# EAGLE design simpleArm-1 (EAGLE 9.5.2)
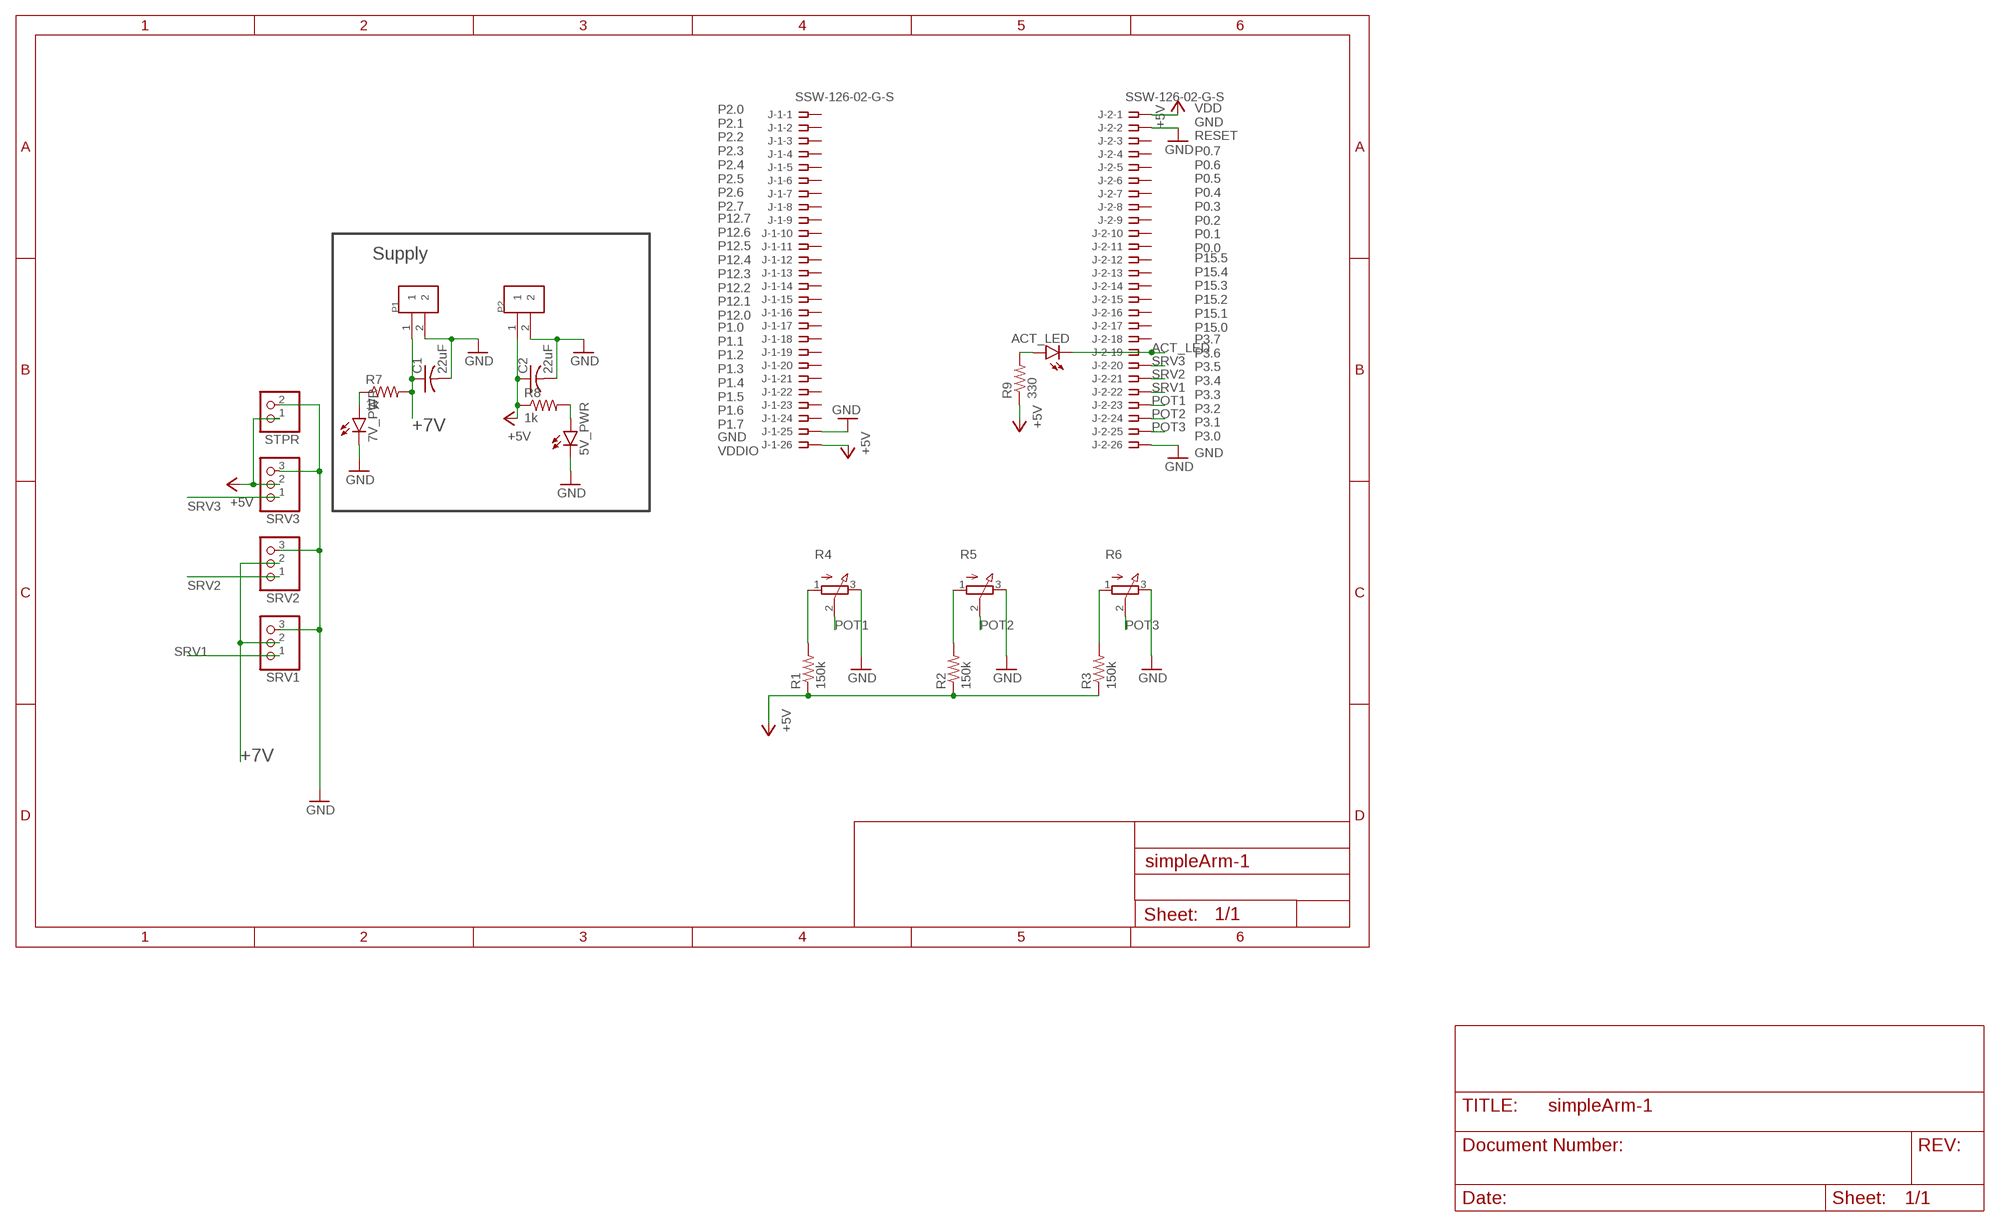
[diagram p0: schematic, sheet 1]

## Parts
5V_PWR  LED3MM  [LED3MM]
7V_PWR  LED3MM  [LED3MM]
ACT_LED  LED3MM  [LED3MM]
C1  22uF  C-US050-030X075  [C050-030X075]
C2  22uF  C-US050-030X075  [C050-030X075]
J-1  SSW-126-02-G-S  [SSW-126-02-G-S]
J-2  SSW-126-02-G-S  [SSW-126-02-G-S]
P1  282837-2  [TE_282837-2]
P2  282837-2  [TE_282837-2]
R1  150k  R-US_0204/7  [0204/7]
R2  150k  R-US_0204/7  [0204/7]
R3  150k  R-US_0204/7  [0204/7]
R4  3RP/1610N  [3RP/1610N]
R5  3RP/1610N  [3RP/1610N]
R6  3RP/1610N  [3RP/1610N]
R7  1k  R-US_0204/7  [0204/7]
R8  1k  R-US_0204/7  [0204/7]
R9  330  R-US_0204/7  [0204/7]
SRV1  PINHD-1X3  [1X03]
SRV2  PINHD-1X3  [1X03]
SRV3  PINHD-1X3  [1X03]
STPR  PINHD-1X2  [1X02]

## Nets
+5V [VCC]: C2.1 J-1.26 J-2.1 P2.1 R1.1 R2.1 R3.1 R8.1 R9.1 SRV3.2 STPR.1
+7V [HighPower]: C1.1 P1.1 R7.2 SRV1.2 SRV2.2
ACT_LED: ACT_LED.K(C) J-2.19
GND [VCC]: 5V_PWR.K(C) 7V_PWR.K(C) C1.2 C2.2 J-1.25 J-2.2 J-2.26 P1.2 P2.2 R4.3(E) R5.3(E) R6.3(E) SRV1.3 SRV2.3 SRV3.3 STPR.2
N$1 [VCC]: R1.2 R4.1(A)
N$2 [VCC]: R2.2 R5.1(A)
N$3 [VCC]: R3.2 R6.1(A)
N$4 [VCC]: 7V_PWR.A R7.1
N$5 [VCC]: 5V_PWR.A R8.2
N$6 [VCC]: ACT_LED.A R9.2
POT1: J-2.23 R4.2(S)
POT2: J-2.24 R5.2(S)
POT3: J-2.25 R6.2(S)
SRV1: J-2.22 SRV1.1
SRV2: J-2.21 SRV2.1
SRV3: J-2.20 SRV3.1
Unconnected: J-1.1 J-1.2 J-1.3 J-1.4 J-1.5 J-1.6 J-1.7 J-1.8 J-1.9 J-1.10 J-1.11 J-1.12 J-1.13 J-1.14 J-1.15 J-1.16 J-1.17 J-1.18 J-1.19 J-1.20 J-1.21 J-1.22 J-1.23 J-1.24 J-2.3 J-2.4 J-2.5 J-2.6 J-2.7 J-2.8 J-2.9 J-2.10 J-2.11 J-2.12 J-2.13 J-2.14 J-2.15 J-2.16 J-2.17 J-2.18

## Notes on the sheet
- VDD
  GND
  RESET
- P2.0
  P2.1
  P2.2
  P2.3
  P2.4
  P2.5
  P2.6
  P2.7
- P0.7
  P0.6
  P0.5
  P0.4
  P0.3
  P0.2
  P0.1
  P0.0
- Supply
- P12.7
  P12.6
  P12.5
  P12.4
  P12.3
  P12.2
  P12.1
  P12.0
- P15.5
  P15.4
  P15.3
  P15.2
  P15.1
  P15.0
- P1.0
  P1.1
  P1.2
  P1.3
  P1.4
  P1.5
  P1.6
  P1.7
- P3.7
  P3.6
  P3.5
  P3.4
  P3.3
  P3.2
  P3.1
  P3.0
- GND
  VDDIO
- GND

## Library data of the parts
5V_PWR 7V_PWR ACT_LED = led:LED: LED OSRAM: - CHIPLED LG R971, LG N971, LY N971, LG Q971, LY Q971, LO R971, LY R971 LH N974, LH R974 LS Q976, LO Q976, LY Q976 LO Q996 - Hyper CHIPLED LW Q18S LB Q993, LB Q99A, LB R99A - SideLED LS A670, LO A670, LY A670, LG A670, LP A670 LB A673, LV A673, LT A673, LW A673 LH A674 LY A675 LS A676, LA A676, LO A676, LY A676, LW A676 LS A679, LY A679, LG A679 - Hyper Micro SIDELED® LS Y876, LA Y876, LO Y876, LY Y876 LT Y87S - SmartLED LW L88C, LW L88S LB L89C, LB L89S, LG L890 LS L89K, LO L89K, LY L89K LS L896, LA L896, LO L896, LY L896 - TOPLED LS T670, LO T670, LY T670, LG T670, LP T670 LSG T670, LSP T670, LSY T670, LOP T670, LYG T670 LG T671, LOG T671, LSG T671 LB T673, LV T673, LT T673, LW T673 LH T674 LS T676, LA T676, LO T676, LY T676, LB T676, LH T676, LSB T676, LW T676 LB T67C, LV T67C, LT T67C, LS T67K, LO T67K, LY T67K, LW E67C LS E67B, LA E67B, LO E67B, LY E67B, LB E67C, LV E67C, LT E67C LW T67C LS T679, LY T679, LG T679 LS T770, LO T770, LY T770, LG T770, LP T770 LB T773, LV T773, LT T773, LW T773 LH T774 LS E675, LA E675, LY E675, LS T675 LS T776, LA T776, LO T776, LY T776, LB T776 LHGB T686 LT T68C, LB T68C - Hyper Mini TOPLED® LB M676 - Mini TOPLED Santana® LG M470 LS M47K, LO M47K, LY M47K Source: http://www.osram.convergy.de LUXEON: - LUMILED® LXK2-PW12-R00, LXK2-PW12-S00, LXK2-PW14-U00, LXK2-PW14-V00 LXK2-PM12-R00, LXK2-PM12-S00, LXK2-PM14-U00 LXK2-PE12-Q00, LXK2-PE12-R00, LXK2-PE12-S00, LXK2-PE14-T00, LXK2-PE14-U00 LXK2-PB12-K00, LXK2-PB12-L00, LXK2-PB12-M00, LXK2-PB14-N00, LXK2-PB14-P00, LXK2-PB14-Q00 LXK2-PR12-L00, LXK2-PR12-M00, LXK2-PR14-Q00, LXK2-PR14-R00 LXK2-PD12-Q00, LXK2-PD12-R00, LXK2-PD12-S00 LXK2-PH12-R00, LXK2-PH12-S00 LXK2-PL12-P00, LXK2-PL12-Q00, LXK2-PL12-R00 Source: www.luxeon.com KINGBRIGHT: KA-3528ASYC Source: www.kingbright.com
C1 C2 = resistor:C-US: CAPACITOR, American symbol
J-1 J-2 = con-samtec:SSW-126-02-G-S: THROUGH-HOLE .025" SQ POST SOCKET Source: Samtec SSW.pdf; MF: Samtec Inc.; MPN: SSW-126-02-G-S; OC_FARNELL: unknown; OC_NEWARK: 11P9742
P1 P2 = 282837-2:282837-2: TERM BLOCK 5.08MM 2POS SIDE ENTY; AVAILABILITY: Unavailable; COMMENT: 282837-2; DESCRIPTION: Connector Terminal Blocks Receptacle 2 Position 5.08mm Solder Straight Thru-Hole 13.5A/Contact; MF: TE Connectivity; MP: 282837-2; PACKAGE: None; PRICE: None; TE_PURCHASE_URL: https://www.te.com/usa-en/product-282837-2.html?te_bu=Cor&te_type=disp&te_campaign=seda_glo_cor-seda-global-disp-prtnr-fy19-seda-model-bom-cta_sma-317_1&elqCampaignId=32493
R1-R3 R7-R9 = resistor:R-US_: RESISTOR, American symbol
R4-R6 = pot:3RP/1610N: 16mm Potentiometer one level Source: http://www.alphapotentiometers.net/html/16mm_pot_2.html
SRV1-SRV3 = pinhead:PINHD-1X3: PIN HEADER
STPR = pinhead:PINHD-1X2: PIN HEADER

## Net classes
0 default: width 0.381 mm, clearance 0.254 mm
1 HighPower: width 1.651 mm, clearance 0.381 mm to class 0
2 VCC: width 1.27 mm, clearance 0.381 mm to class 0, clearance 0.381 mm

## Board
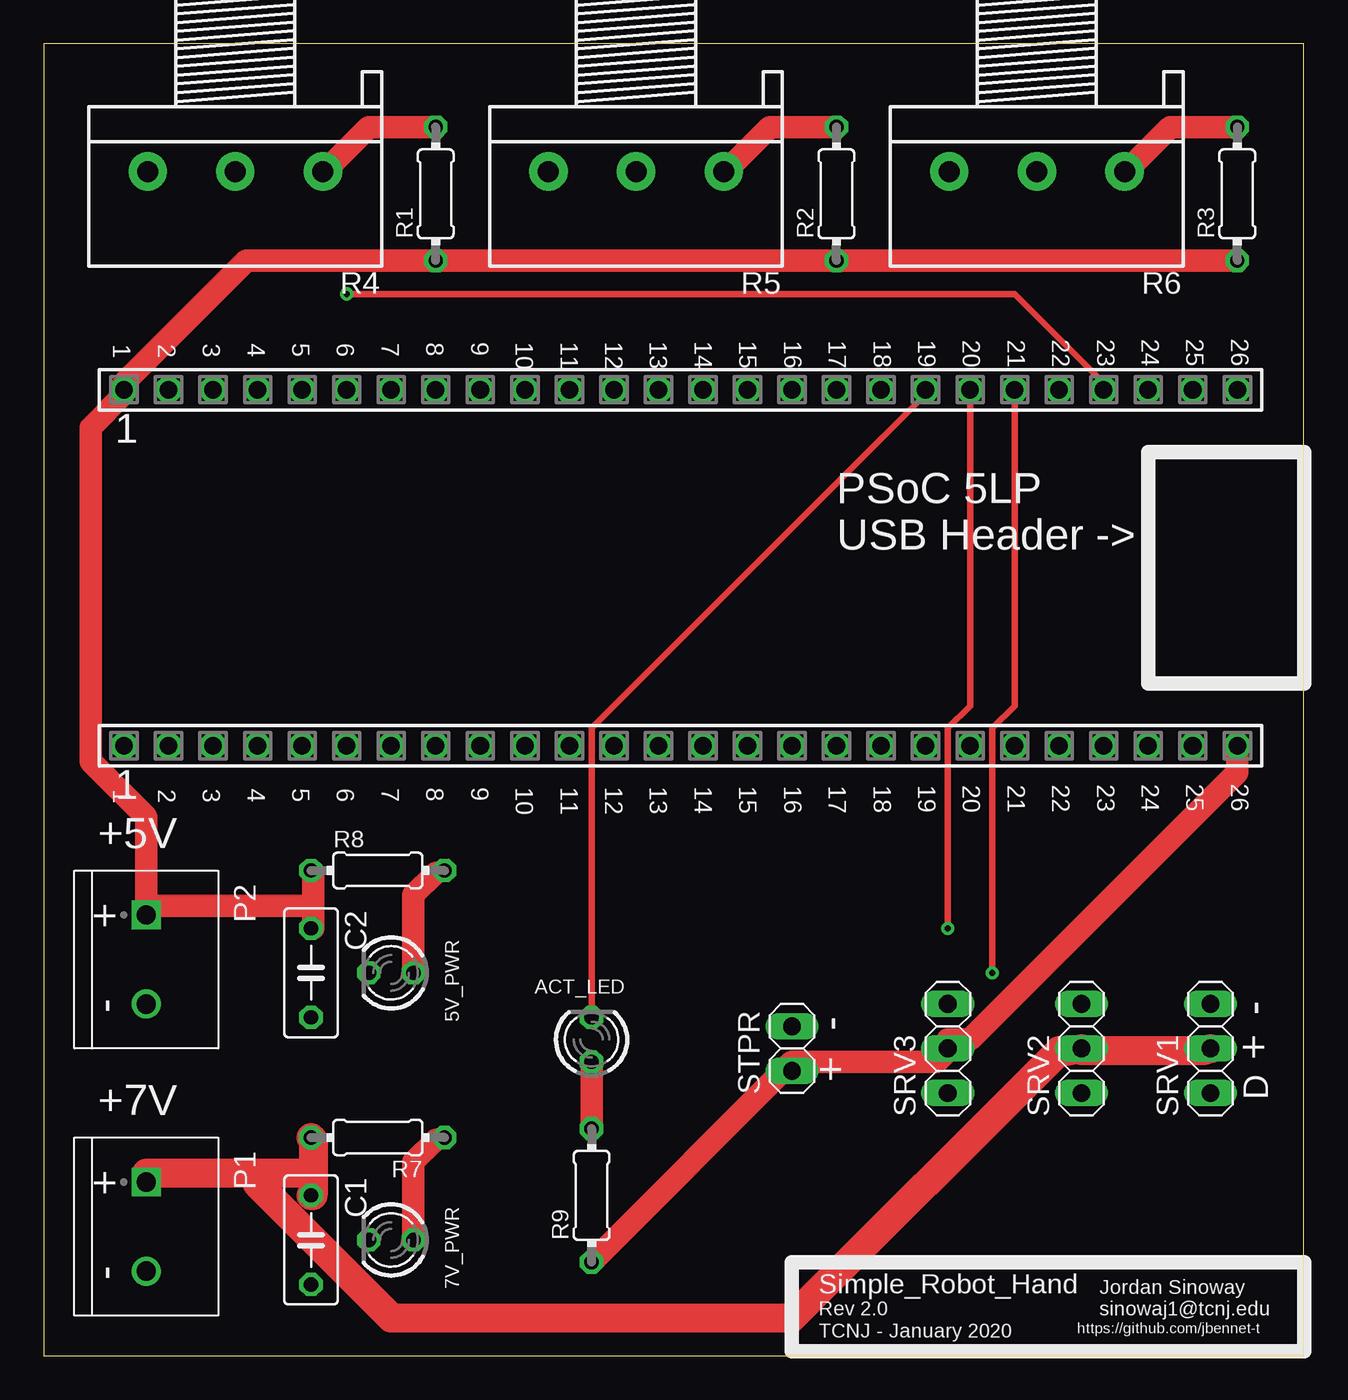
[diagram p1: board, top side]
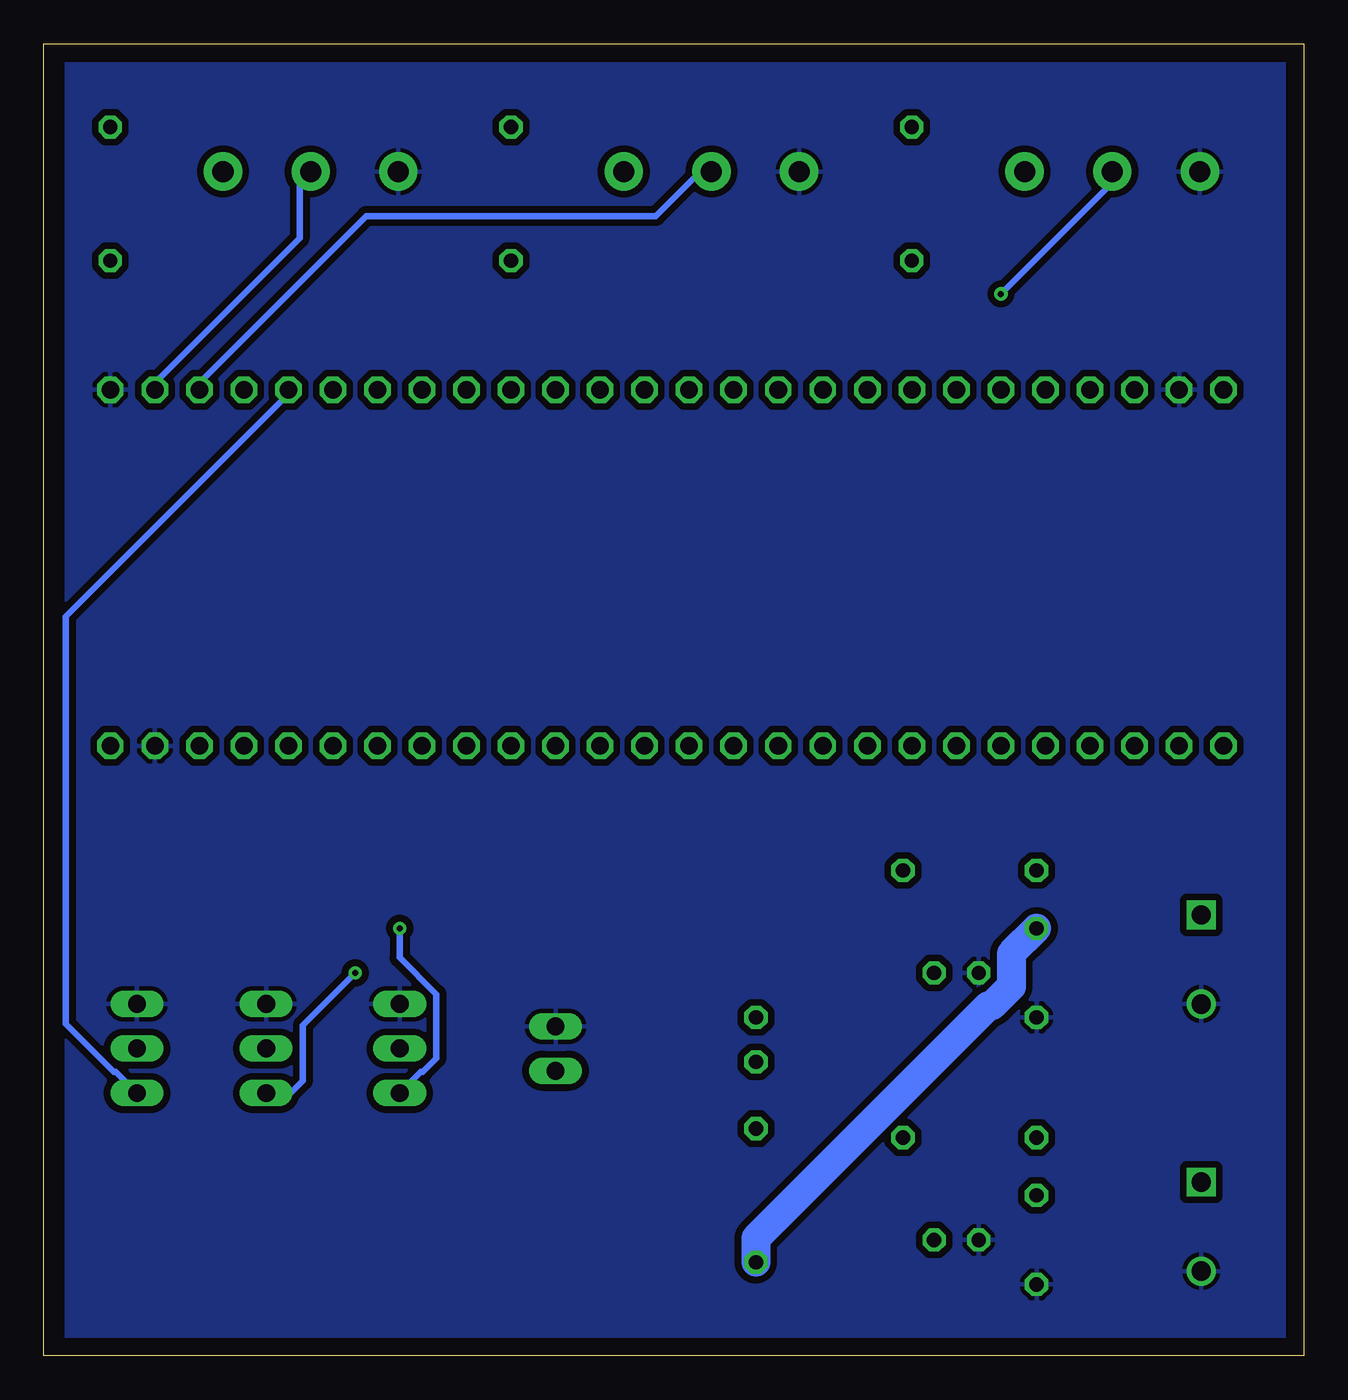
[diagram p2: board, bottom side, seen from below]

Size 71.86 x 74.85 mm. Coordinates in mm from the lower left corner, seen from the top.
Outline: 0,0 71.86,0 71.86,74.85 0,74.85 0,0
Copper layers (1*16): Top 0.035mm / dielectric 1.5mm / Bottom 0.035mm
Design rules "default": minimum track width 6mil, minimum drill 0.35mm, track to track 6mil, track to pad 6mil, pad to pad 6mil, via to via 6mil, smd to smd 6mil, copper to edge 40mil, drill to drill 6mil, minimum pad ring 10mil, minimum via ring 8mil, stop-mask expansion 4mil, vias tented up to drill 0mil, thermal gap 10mil

### Footprints (pad centres in the part's own frame; a part is rotated, then mirrored left to right if it is on the bottom)
LED3MM = drill 0.813 octagon: A -1.27,0; K 1.27,0
C050-030X075 = drill 0.813 octagon: 1 -2.54,0; 2 2.54,0
SSW-126-02-G-S = drill 1 pad 1.5 octagon: 1 -31.75,0; 2 -29.21,0; 3 -26.67,0; 4 -24.13,0; 5 -21.59,0; 6 -19.05,0; 7 -16.51,0; 8 -13.97,0; 9 -11.43,0; 10 -8.89,0; 11 -6.35,0; 12 -3.81,0; 13 -1.27,0; 14 1.27,0; 15 3.81,0; 16 6.35,0; 17 8.89,0; 18 11.43,0; 19 13.97,0; 20 16.51,0; 21 19.05,0; 22 21.59,0; 23 24.13,0; 24 26.67,0; 25 29.21,0; 26 31.75,0
TE_282837-2 = drill 1.1 square: 1 -2.54,0 | drill 1.1: 2 2.54,0
0204/7 = drill 0.813 octagon: 1 -3.81,0; 2 3.81,0
3RP/1610N = drill 1.2 pad 2.184: 1 -5,0; 2 0,0; 3 5,0
1X03 = drill 1.016 long: 1 -2.54,0; 2 0,0; 3 2.54,0
1X02 = drill 1.016 long: 1 -1.27,0; 2 1.27,0

### Placement (x,y rotation side)
5V_PWR  19.81,21.84 180 top
7V_PWR  19.81,6.6 180 top
ACT_LED  31.24,18.03 90 top
C1  15.24,6.6 270 top
C2  15.24,21.84 270 top
J-1  36.32,34.8 0 top
J-2  36.32,55.12 0 top
P1  5.84,7.37 270 top
P2  5.84,22.61 270 top
R1  22.35,66.29 90 top
R2  45.21,66.29 90 top
R3  68.07,66.29 90 top
R4  10.92,67.56 180 top
R5  33.78,67.56 180 top
R6  56.64,67.56 180 top
R7  19.05,12.45 180 top
R8  19.05,27.69 0 top
R9  31.24,9.14 90 top
SRV1  66.55,17.53 90 top
SRV2  59.18,17.53 90 top
SRV3  51.56,17.53 90 top
STPR  42.67,17.53 90 top

### Tracks (layer width: path | path; a pad name or v marks a point on that pad's centre or on a via)
+5V
  Top 1.27: 42.67,16.76 R9.1 | J-1.26 68.07,33.27 52.83,18.03 51.56,18.03 SRV3.2 51.56,17.4 50.93,16.76 42.67,16.76 | 42.67,16.76 STPR.1 | 15.37,25.65 15.37,27.56 R8.1 | 15.37,25.65 15.37,24.38 C2.1 | 15.37,25.65 5.84,25.65 | R3.1 R2.1 R1.1 11.56,62.48 4.57,55.5 J-2.1 4.57,54.86 2.67,52.96 2.67,33.91 5.84,30.73 5.84,25.65 | 5.84,25.65 P2.1
  Bottom 1.651: C2.1 16.67,22.95 16.67,21.07 17.77,19.98 17.97,19.98 31.24,6.7 R9.1
+7V
  Top 1.651: SRV1.2 66.17,17.4 59.18,17.4 SRV2.2 58.55,17.4 57.91,17.4 42.67,2.16 19.81,2.16 12.19,9.78 12.19,10.41 | 15.37,10.41 15.37,12.32 R7.2 | 15.37,10.41 15.37,9.14 C1.1 | 15.37,10.41 12.19,10.41 | 12.19,10.41 5.84,10.41 P1.1
ACT_LED
  Top 0.381: ACT_LED.K 31.24,35.81 50.29,54.86 J-2.19
GND
  pour Bottom: 0.76,73.91 70.61,73.91 70.61,1.02 0.76,1.02
N$1
  Top 1.27: R1.2 18.54,70.1 16,67.56 R4.1
N$2
  Top 1.27: R2.2 41.4,70.1 38.86,67.56 R5.1
N$3
  Top 1.27: R3.2 64.26,70.1 61.72,67.56 R6.1
N$4
  Top 1.27: 7V_PWR.A 21.08,11.05 22.35,12.32 R7.1
N$5
  Top 1.27: 5V_PWR.A 21.08,26.29 22.35,27.56 R8.2
N$6
  Top 1.27: ACT_LED.A R9.2
POT1  (via drill 0.35)
  Top 0.381: v17.27,60.58 55.37,60.58 60.45,55.5 J-2.23
  Bottom 0.381: v17.27,60.58 10.92,66.93 R4.2
POT2
  Bottom 0.381: R5.2 34.42,67.56 36.96,65.02 53.47,65.02 62.99,55.5 J-2.24
POT3
  Bottom 0.381: R6.2 57.28,67.56 57.28,63.75 65.53,55.5 J-2.25
SRV1
  Bottom 0.381: J-2.22 57.91,54.86 70.61,42.16 70.61,18.94 67.86,16.19 67.75,16.19 SRV1.1
SRV2  (via drill 0.35)
  Top 0.381: J-2.21 55.37,37.08 54.1,35.81 v54.1,21.84
  Bottom 0.381: SRV2.1 59.18,14.86 57.91,14.86 57.09,15.68 57.09,18.86 v54.1,21.84
SRV3  (via drill 0.35)
  Top 0.381: J-2.20 52.83,37.08 51.56,35.81 v51.56,24.38
  Bottom 0.381: v51.56,24.38 51.56,22.71 49.47,20.62 49.47,16.97 50.25,16.19 50.36,16.19 SRV3.1

### Text on the board
tPlace: PSoC 5LP / USB Header -> | https://github.com/jbennet-t
tNames: 26 / 25 / 24 / 23 / 22 / 21 / 20 / 19 / 18 / 17 / 16 / 15 / 14 / 13 / 12 / 11 / 10 / 9 / 8 / 7 / 6 / 5 / 4 / 3 / 2 / 1 | 26 / 25 / 24 / 23 / 22 / 21 / 20 / 19 / 18 / 17 / 16 / 15 / 14 / 13 / 12 / 11 / 10 / 9 / 8 / 7 / 6 / 5 / 4 / 3 / 2 / 1 | +5V | + | - | - | - | + | +7V | + | D | + | - | Simple_Robot_Hand | Rev 2.0 | Jordan Sinoway / sinowaj1@tcnj.edu | TCNJ - January 2020